# Altium schematic sheet Controles_Encoder.SchDoc
size A4; SheetNumber: 19; SheetTotal: 19
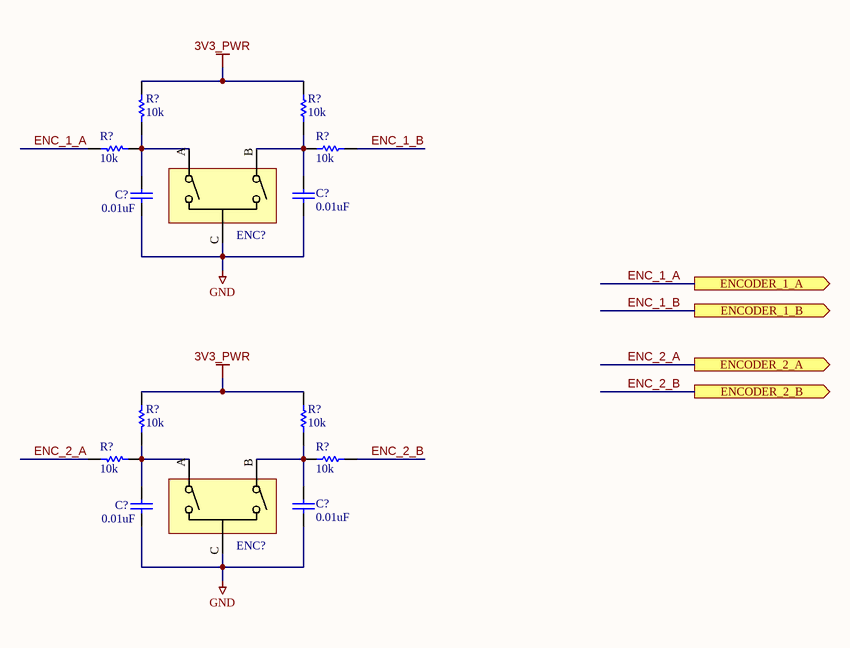
[diagram p0: Controles_Encoder.SchDoc]

## Parts
(Parts that share a designator on the sheet are numbered #1, #2 ... from top to bottom, then left to right.)
C?#1  0.01uF  [CAPC1005X55X25LL05T10]
C?#2  0.01uF  [CAPC1005X55X25LL05T10]
C?#3  0.01uF  [CAPC1005X55X25LL05T10]
C?#4  0.01uF  [CAPC1005X55X25LL05T10]
ENC?#1  Encoder  [PEC09-2315F-N0015]  (value not drawn)
ENC?#2  Encoder  [PEC09-2315F-N0015]  (value not drawn)
R?#1  10k  [RESC1005X40X25ML05T05]
R?#2  10k  [RESC1005X40X25ML05T05]
R?#3  10k  [RESC1005X40X25ML05T05]
R?#4  10k  [RESC1005X40X25ML05T05]
R?#5  10k  [RESC1005X40X25ML05T05]
R?#6  10k  [RESC1005X40X25ML05T05]
R?#7  10k  [RESC1005X40X25ML05T05]
R?#8  10k  [RESC1005X40X25ML05T05]

## Ports
ENCODER_1_A (out), ENCODER_1_B (out), ENCODER_2_A (out), ENCODER_2_B (out)

## Nets
3V3_PWR: R?#1.1 R?#2.1 R?#5.1 R?#6.1
GND: C?#1.1 C?#2.1 C?#3.1 C?#4.1 ENC?#1.C(COM) ENC?#2.C(COM)
ENC_1_A: R?#3.1 ; port ENCODER_1_A
ENC_1_B: R?#4.1 ; port ENCODER_1_B
ENC_2_A: R?#7.1 ; port ENCODER_2_A
ENC_2_B: R?#8.1 ; port ENCODER_2_B
NetC?#1_2: C?#1.2 ENC?#1.A(COM) R?#1.2 R?#3.2
NetC?#2_2: C?#2.2 ENC?#1.B(COM) R?#2.2 R?#4.2
NetC?#3_2: C?#3.2 ENC?#2.A(COM) R?#5.2 R?#7.2
NetC?#4_2: C?#4.2 ENC?#2.B(COM) R?#6.2 R?#8.2

## Library data of the parts
C?#1-C?#4 = CMP-1034-01880-2: Manufacturer: Murata; Part Number: GRM155R71E103KA01D
ENC?#1 ENC?#2 = PEC09-2315F-N0015: PEC09 PC Pin Quadrature (Incremental) 12 Mechanical Encoder 11.4mm 70C; Manufacturer: Bourns; Built in Switch: No; Detent: Yes; Number of Circuits: 1; Output Type: Incremental, Quadrature; Pulses per Revolution: 12; Supplier: DigiKey; Supplier Part Number: 118-PEC09-2315F-N0015-ND; Manufacturer Part Number: PEC09-2315F-N0015; RoHS: Compliant; Category: Encoders; Stock: 1221; Pricing: 1=2.47, 10=2.078, 25=1.9392, 50=1.8398, 100=1.745, 300=1.60387, 500=1.54196, 1000=1.46156, 5000=1.29003 (USD); Country of Origin: Taiwan; Encoder Type: Mechanical; Introduction Date: 2010-10-15; Lifecycle Status: Production; Max Operating Temperature: 70°C; Min Operating Temperature: -10°C; Mounting Technology: PCB, Panel, Through Hole; Orientation: Right Angle; REACH SVHC: Yes; Schedule B: 8543709655; Termination: PC Pin; Width: 9.7mm; ComponentLink1URL: https://datasheet.octopart.com:443/PEC09-2315F-N0015-Bourns-datasheet-179971531.pdf?src-supplier=IHS; ComponentLink1Description: https://datasheet.octopart.com:443/PEC09-2315F-N0015-Bourns-datasheet-179971531.pdf?src-supplier=IHS; ComponentLink2URL: https://datasheet.octopart.com:443/PEC09-2315F-N0015-Bourns-datasheet-67810299.pdf?src-supplier=JRH+Electronics; ComponentLink2Description: https://datasheet.octopart.com:443/PEC09-2315F-N0015-Bourns-datasheet-67810299.pdf?src-supplier=JRH+Electronics; ComponentLink3URL: https://datasheet.octopart.com:443/PEC09-2315F-N0015-Bourns-datasheet-177040331.pdf?src-supplier=Burklin+Elektronik; ComponentLink3Description: https://datasheet.octopart.com:443/PEC09-2315F-N0015-Bourns-datasheet-177040331.pdf?src-supplier=Burklin+Elektronik; ComponentLink4URL: https://datasheet.octopart.com/PEC09-2315F-N0015-Bourns-datasheet-10938969.pdf; ComponentLink4Description: https://datasheet.octopart.com/PEC09-2315F-N0015-Bourns-datasheet-10938969.pdf; ComponentLink5URL: http://sigma.octopart.com:80/conflict_mineral_statement/Bourns-company-36.pdf?src-supplier=Compliance+Statements; ComponentLink5Description: http://sigma.octopart.com:80/conflict_mineral_statement/Bourns-company-36.pdf?src-supplier=Compliance+Statements
R?#1-R?#8 = CMP-2002-00601-1: Manufacturer: Panasonic; Part Number: ERJ-2RHD1002X